# Altium schematic sheet RF_Antenna_Power.SchDoc: RF and Crystal
size Letter; Author: Parth Thakkar; Organization: Low Self Esteam; Revision: v1.0; SheetNumber: 2; SheetTotal: 8
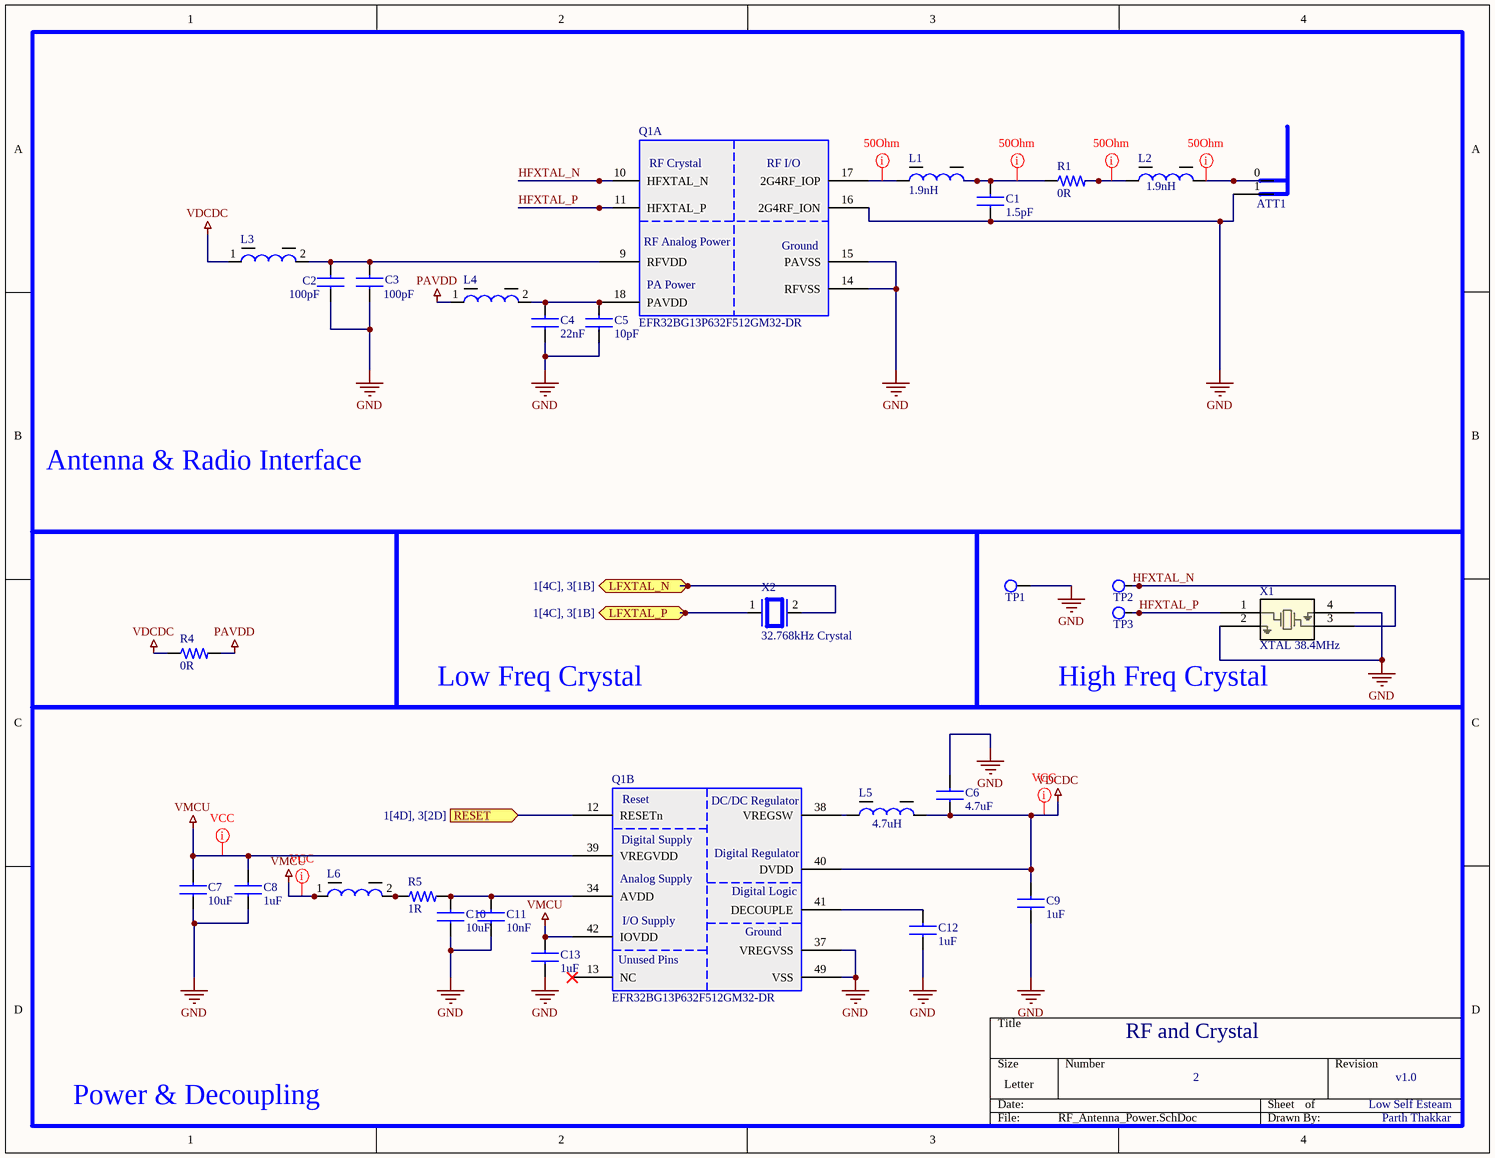
[diagram p0: RF_Antenna_Power.SchDoc]

## Parts
ATT1  F_Interverted  [F_Inverted]  (value not drawn)  (net tie, no BOM)
C1  value 1.5pF  [Capacitor 0402]  (hidden comment: CAP 1.5pF 50V 0402)
C2  value 100pF  [Capacitor 0603]  (hidden comment: CAP 100pF 100V 0603)
C3  value 100pF  [Capacitor 0603]  (hidden comment: CAP 100pF 100V 0603)
C4  value 22nF  [Capacitor 0603]  (hidden comment: CAP 220nF 50V 0603)
C5  value 10pF  [Capacitor 0603]  (hidden comment: CAP 10pF 50V 0603)
C6  value 4.7uF  [Capacitor 0603]  (hidden comment: CAP 4.7uF 25V 0603)
C7  value 10uF  [Capacitor 0603]  (hidden comment: CAP 10uF 10V 0603)
C8  value 1uF  [Capacitor 0603]  (hidden comment: CAP 1uF 10V 0603)
C9  value 1uF  [Capacitor 0603]  (hidden comment: CAP 1uF 10V 0603)
C10  value 10uF  [Capacitor 0603]  (hidden comment: CAP 10uF 10V 0603)
C11  value 10nF  [Capacitor 0603]  (hidden comment: CAP 10nF 100V 0603)
C12  value 1uF  [Capacitor 0603]  (hidden comment: CAP 1uF 10V 0603)
C13  value 1uF  [Capacitor 0603]  (hidden comment: CAP 1uF 10V 0603)
L1  1.9nH  [Ferrite 0402]
L2  1.9nH  [Ferrite 0402]
L3  Ferrite Bead 600(601) 1LN  [Ferrite 0603]  (value not drawn)
L4  Ferrite Bead 600(601) 1LN  [Ferrite 0603]  (value not drawn)
L5  Inductance-Nom (L): 4.7uH  [IND 22uH (1.6x4.3)]  (hidden comment: IND 4.7uH 1515)
L6  Farrite Bead 102(1k)  [Ferrite 0402]  (value not drawn)
Q1  EFR32BG13P632F512GM32-DR  [EFR32BG]  (parts A,B of 3)
R1  value 0R  [Resistor 0402]  (hidden comment: RES 0R 0402)
R4  value 0R  [Resistor 0402]  (hidden comment: RES 0R 0402)
R5  value 1R  [Resistor 0603]  (hidden comment: RES 1R 0603)
TP1  Test point  [Test Point]  (value not drawn)  (net tie, no BOM)
TP2  Test point  [Test Point]  (value not drawn)  (net tie, no BOM)
TP3  Test point  [Test Point]  (value not drawn)  (net tie, no BOM)
X1  XTAL 38.4MHz  [XTAL 38.4MHz]
X2  32.768kHz Crystal  [XTAL_32.768KHZ-T]

## Blocks framed on the sheet
Antenna & Radio Interface: ATT1 C1-C5 L1-L4 Q1 R1
Low Freq Crystal: X2
High Freq Crystal: TP1-TP3 X1
Power & Decoupling: C6-C13 L5 L6 Q1 R5

## Ports
LFXTAL_N (bidir, see 1[4C], 3[1B]), LFXTAL_P (bidir, see 1[4C], 3[1B]), RESET (in, see 1[4D], 3[2D])

## Nets
GND: ATT1.1(GND) C1.2 C2.2 C3.2 C4.2 C5.2 C6.2 C7.2 C8.2 C9.2 C10.2 C11.2 C12.2 C13.2 Q1.14(RFVSS) Q1.15(PAVSS) Q1.16(2G4RF_ION) Q1.37(VREGVSS) Q1.49(VSS) TP1.1 X1.2 X1.4
PAVDD: L4.1 R4.2
VDCDC: C6.1 C9.1 L3.1 L5.2 Q1.40(DVDD) R4.1
VMCU: C7.1 C8.1 C13.1 L6.1 Q1.39(VREGVDD) Q1.42(IOVDD)
HFXTAL_N: Q1.10(HFXTAL_N) TP2.1 X1.3
HFXTAL_P: Q1.11(HFXTAL_P) TP3.1 X1.1
LFXTAL_N: X2.2 ; port LFXTAL_N
LFXTAL_P: X2.1 ; port LFXTAL_P
RESET: Q1.12(RESETn) ; port RESET
NetATT1_0: ATT1.0(FEED) L2.2
NetC1_1: C1.1 L1.2 R1.1
NetC2_1: C2.1 C3.1 L3.2 Q1.9(RFVDD)
NetC4_1: C4.1 C5.1 L4.2 Q1.18(PAVDD)
NetC10_1: C10.1 C11.1 Q1.34(AVDD) R5.2
NetC12_1: C12.1 Q1.41(DECOUPLE)
NetL1_1: L1.1 Q1.17(2G4RF_IOP)
NetL2_1: L2.1 R1.2
NetL5_1: L5.1 Q1.38(VREGSW)
NetL6_2: L6.2 R5.1

Not connected (* = marked no-connect by the designer): Q1 13(NC)*

## Layout directives
rule Width Constraint [Pref Width = 20mil    Min Width = 6mil    Max Width = 20mil]: VDCDC, VMCU
net class RF: NetATT1_0, NetC1_1, NetL1_1, NetL2_1

## Notes on the sheet
- (in symbol EFR32BG13P632F512GM32-DR, part A) RF Crystal; RF I/O; RF Analog Power; Ground; PA Power
- (in symbol EFR32BG13P632F512GM32-DR, part B) Reset; DC/DC Regulator; Digital Supply; Digital Regulator; Analog Supply; Digital Logic; I/O Supply; Ground; Unused Pins

## Library data of the parts
ATT1 = F_Interverted: For 50Ohm impedence, Inverted F antenna; pin to pad: 0>FEED 1>GND
C1 = CAP 1.5pF 50V 0402: Ceramic Capacitor, Multilayer, Ceramic, 50V, 3.33% +Tol, 3.33% -Tol, C0G, 30ppm/Cel TC, 0.0000015uF, Surface Mount, 0402; Manufacturer: Murata; Manufacturer Part Number: GJM1555C1H1R5WB01D; Multilayer: Yes; Supplier: Digikey; Supplier Part Number: 490-11199-1-ND; RoHS: Yes; Category: Ceramic Capacitors; Stock: 52422; Pricing: 1=0.16, 10=0.091, 50=0.0634, 100=0.0549, 500=0.04062, 1000=0.03616, 2500=0.03144, 5000=0.02857 (USD); Mounting Technology: Surface Mount; Pins: 2; Dielectric Material: Ceramic; Package Shape: Rectangular; Case/Package: 0402; Terminal Finish: Nickel; Min Operating Temperature: -55°C; Max Operating Temperature: 125°C; JESD-609 Code: e3; Capacitor Type: Ceramic; Tolerance  (fill in as +-): 3.33%; Package Style: SMTMeter; Packaging: Tape and Reel; Tolerance (fill in as +-): 3.33%; Rated DC Voltage (URdc): 50V; Temperature Characteristics Code: C0G; Termination: Wraparound; Length: 1mm; Width: 0.5mm; Height: 0.5mm; Reach SVHC Compliant: Yes; RoHS Compliant: Yes; ComponentLink1URL: https://datasheet.ciiva.com:443/pdfs/VipMasterIC/IC/MURE/MURE-S-A0004378008/MURE-S-A0004383770-1.pdf?src-supplier=IHS+Markit; ComponentLink1Description: https://datasheet.ciiva.com:443/pdfs/VipMasterIC/IC/MURE/MURE-S-A0004378008/MURE-S-A0004383770-1.pdf?src-supplier=IHS+Markit; ComponentLink2URL: https://datasheet.ciiva.com/18183/getdatasheetpartid-312921-18183825.pdf?src-supplier=Verical; ComponentLink2Description: https://datasheet.ciiva.com/18183/getdatasheetpartid-312921-18183825.pdf?src-supplier=Verical
C2 C3 = CAP 100pF 100V 0603: Ceramic Capacitor, Multilayer, Ceramic, 100V, 5% +Tol, 5% -Tol, C0G, 30ppm/Cel TC, 0.0001uF, Surface Mount, 0603; Manufacturer: Murata; Manufacturer Part Number: GCM1885C2A101JA16D; Multilayer: Yes; Reference Standard: AEC-Q200; Supplier: Digikey; Supplier Part Number: 490-4771-1-ND; RoHS: Yes; Category: Ceramic Capacitors; Stock: 419530; Pricing: 1=0.1, 10=0.041, 50=0.0278, 100=0.0237, 500=0.017, 1000=0.01491 (USD); Mounting Technology: Surface Mount; Pins: 2; Dielectric Material: Ceramic; Package Shape: Rectangular; Case/Package: 0603; Terminal Finish: Nickel; Min Operating Temperature: -55°C; Max Operating Temperature: 125°C; JESD-609 Code: e3; Capacitor Type: Ceramic; Tolerance  (fill in as +-): 5%; Package Style: SMTMeter; Packaging: Tape and Reel; Tolerance (fill in as +-): 5%; Rated DC Voltage (URdc): 100V; Temperature Characteristics Code: C0G; Termination: Wraparound; Length: 1.6mm; Width: 0.8mm; Height: 0.9mm; Reach SVHC Compliant: Yes; RoHS Compliant: Yes; ComponentLink1URL: https://datasheet.ciiva.com:443/pdfs/VipMasterIC/IC/MURE/MURE-S-A0004365318/MURE-S-A0004370465-1.pdf?src-supplier=IHS+Markit; ComponentLink1Description: https://datasheet.ciiva.com:443/pdfs/VipMasterIC/IC/MURE/MURE-S-A0004365318/MURE-S-A0004370465-1.pdf?src-supplier=IHS+Markit; ComponentLink2URL: https://datasheet.ciiva.com/133/product-133309.pdf?src-supplier=Digikey; ComponentLink2Description: https://datasheet.ciiva.com/133/product-133309.pdf?src-supplier=Digikey; ComponentLink3URL: https://datasheet.ciiva.com/133/product-133310.pdf?src-supplier=Digikey; ComponentLink3Description: https://datasheet.ciiva.com/133/product-133310.pdf?src-supplier=Digikey; ComponentLink4URL: https://datasheet.ciiva.com/133/product-133311.pdf?src-supplier=Digikey; ComponentLink4Description: https://datasheet.ciiva.com/133/product-133311.pdf?src-supplier=Digikey; ComponentLink5URL: https://datasheet.ciiva.com/18183/getdatasheetpartid-223913-18183585.pdf?src-supplier=Verical; ComponentLink5Description: https://datasheet.ciiva.com/18183/getdatasheetpartid-223913-18183585.pdf?src-supplier=Verical; ComponentLink6URL: https://datasheet.ciiva.com/11605/product-11605527.pdf?src-supplier=Avnet; ComponentLink6Description: https://datasheet.ciiva.com/11605/product-11605527.pdf?src-supplier=Avnet
C4 = CAP 220nF 50V 0603: Ceramic Capacitor, Multilayer, Ceramic, 50V, 10% +Tol, 10% -Tol, X7R, 15% TC, 0.022uF, Surface Mount, 0603; Manufacturer: Murata; Manufacturer Part Number: GRM155R71H223KA12D; Multilayer: Yes; Reference Standard: AEC-Q200; Supplier: Digikey; Supplier Part Number: 490-3884-1-ND; RoHS: Yes; Category: Ceramic Capacitors; Stock: 581872; Pricing: 1=0.1, 10=0.022, 50=0.0148, 100=0.0125, 500=0.00878, 1000=0.00762, 2500=0.00639, 5000=0.00565, 10000=0.00504, 20000=0.00453, 30000=0.00428, 50000=0.004, 70000=0.00383, 100000=0.00367, 250000=0.00333, 500000=0.00312, 1000000=0.00294 (USD); Mounting Technology: Surface Mount; Pins: 2; Dielectric Material: Ceramic; Package Shape: Rectangular; Case/Package: 0402; Terminal Finish: Nickel; Min Operating Temperature: -55°C; Max Operating Temperature: 125°C; JESD-609 Code: e3; Capacitor Type: Ceramic; Tolerance  (fill in as +-): 10%; Package Style: SMTMeter; Packaging: Tape and Reel; Tolerance (fill in as +-): 10%; Rated DC Voltage (URdc): 50V; Temperature Characteristics Code: X7R; Termination: Wraparound; Length: 1mm; Width: 0.5mm; Height: 0.5mm; Reach SVHC Compliant: Yes; RoHS Compliant: Yes; ComponentLink1URL: https://datasheet.ciiva.com:443/pdfs/VipMasterIC/IC/MURE/MURE-S-A0008911298/MURE-S-A0008911312-1.pdf?src-supplier=IHS+Markit; ComponentLink1Description: https://datasheet.ciiva.com:443/pdfs/VipMasterIC/IC/MURE/MURE-S-A0008911298/MURE-S-A0008911312-1.pdf?src-supplier=IHS+Markit; ComponentLink2URL: https://datasheet.ciiva.com/11789/0900766b80ef921d-11789142.pdf?src-supplier=Rs; ComponentLink2Description: https://datasheet.ciiva.com/11789/0900766b80ef921d-11789142.pdf?src-supplier=Rs; ComponentLink3URL: https://datasheet.ciiva.com/18184/getdatasheetpartid-178940-18184738.pdf?src-supplier=Verical; ComponentLink3Description: https://datasheet.ciiva.com/18184/getdatasheetpartid-178940-18184738.pdf?src-supplier=Verical; ComponentLink4URL: https://datasheet.ciiva.com/29199/454297-da-01-en-vs-kondensator-0402-29199766.pdf?src-supplier=Conrad; ComponentLink4Description: https://datasheet.ciiva.com/29199/454297-da-01-en-vs-kondensator-0402-29199766.pdf?src-supplier=Conrad; ComponentLink5URL: https://datasheet.ciiva.com/7937/608985-7937629.pdf?src-supplier=Element14; ComponentLink5Description: https://datasheet.ciiva.com/7937/608985-7937629.pdf?src-supplier=Element14; ComponentLink6URL: https://datasheet.ciiva.com/131/partnumbering-e-01-131078.pdf?src-supplier=Digikey; ComponentLink6Description: https://datasheet.ciiva.com/131/partnumbering-e-01-131078.pdf?src-supplier=Digikey; ComponentLink7URL: https://datasheet.ciiva.com/131/partnumbering-e-01-131079.pdf?src-supplier=Digikey; ComponentLink7Description: https://datasheet.ciiva.com/131/partnumbering-e-01-131079.pdf?src-supplier=Digikey; ComponentLink8URL: https://datasheet.ciiva.com/131/partnumbering-e-01-131080.pdf?src-supplier=Digikey; ComponentLink8Description: https://datasheet.ciiva.com/131/partnumbering-e-01-131080.pdf?src-supplier=Digikey; ComponentLink9URL: https://datasheet.ciiva.com/22698/608985-22698424.pdf?src-supplier=Element14; ComponentLink9Description: https://datasheet.ciiva.com/22698/608985-22698424.pdf?src-supplier=Element14; ComponentLink10URL: https://datasheet.ciiva.com/16440/l0005e-16440589.pdf?src-supplier=Future+Electronics; ComponentLink10Description: https://datasheet.ciiva.com/16440/l0005e-16440589.pdf?src-supplier=Future+Electronics; ComponentLink11URL: https://datasheet.ciiva.com:443/pdfs/VipMasterIC/IC/MURE/MURE-S-A0004362469/MURE-S-A0004362882-1.pdf?src-supplier=IHS+Markit; ComponentLink11Description: https://datasheet.ciiva.com:443/pdfs/VipMasterIC/IC/MURE/MURE-S-A0004362469/MURE-S-A0004362882-1.pdf?src-supplier=IHS+Markit; ComponentLink12URL: https://datasheet.ciiva.com/29540/product-29540839.pdf?src-supplier=Digikey; ComponentLink12Description: https://datasheet.ciiva.com/29540/product-29540839.pdf?src-supplier=Digikey; ComponentLink13URL: https://datasheet.ciiva.com/29540/product-29540840.pdf?src-supplier=Digikey; ComponentLink13Description: https://datasheet.ciiva.com/29540/product-29540840.pdf?src-supplier=Digikey; ComponentLink14URL: https://datasheet.ciiva.com/29540/product-29540841.pdf?src-supplier=Digikey; ComponentLink14Description: https://datasheet.ciiva.com/29540/product-29540841.pdf?src-supplier=Digikey; ComponentLink15URL: https://datasheet.ciiva.com/11619/product-11619420.pdf?src-supplier=Avnet; ComponentLink15Description: https://datasheet.ciiva.com/11619/product-11619420.pdf?src-supplier=Avnet
C5 = CAP 10pF 50V 0603: Ceramic Capacitor, Multilayer, Ceramic, 100V, 5% +Tol, 5% -Tol, C0G, 30ppm/Cel TC, 0.00001uF, Surface Mount, 0603; Manufacturer: Murata; Manufacturer Part Number: GRM1555C1H100FA01D; Multilayer: Yes; Tolerance  (fill in as +-): 1%; Reference Standard: AEC-Q200; Supplier: Digikey; Supplier Part Number: 490-6186-1-ND; RoHS: Yes; Category: Ceramic Capacitors; Stock: 4693307; Pricing: 1=0.1, 10=0.03, 50=0.0204, 100=0.0174, 500=0.0125, 1000=0.01097, 2500=0.00936, 5000=0.00838 (USD); Mounting Technology: Surface Mount; Pins: 2; Dielectric Material: Ceramic; Package Shape: Rectangular; Case/Package: 0402; Terminal Finish: Nickel; Min Operating Temperature: -55°C; Max Operating Temperature: 125°C; JESD-609 Code: e3; Capacitor Type: Ceramic; Packaging: Tape and Reel; Tolerance (fill in as +-): 1%; Rated DC Voltage (URdc): 50V; Temperature Characteristics Code: C0G; Termination: Wraparound; Reach SVHC Compliant: Yes; RoHS Compliant: Yes; ComponentLink1URL: https://datasheet.ciiva.com:443/pdfs/VipMasterIC/IC/MURE/MURE-S-A0004347008/MURE-S-A0004347294-1.pdf?src-supplier=IHS+Markit; ComponentLink1Description: https://datasheet.ciiva.com:443/pdfs/VipMasterIC/IC/MURE/MURE-S-A0004347008/MURE-S-A0004347294-1.pdf?src-supplier=IHS+Markit; ComponentLink2URL: https://datasheet.ciiva.com/6263/partnumbering-e-01-6263819.pdf?src-supplier=Digikey; ComponentLink2Description: https://datasheet.ciiva.com/6263/partnumbering-e-01-6263819.pdf?src-supplier=Digikey; ComponentLink3URL: https://datasheet.ciiva.com/6263/partnumbering-e-01-6263822.pdf?src-supplier=Digikey; ComponentLink3Description: https://datasheet.ciiva.com/6263/partnumbering-e-01-6263822.pdf?src-supplier=Digikey; Package Style: SMTMeter; Length: 1.6mm; Width: 0.8mm; Height: 0.9mm; ComponentLink4URL: https://datasheet.ciiva.com:443/pdfs/VipMasterIC/IC/MURE/MURE-S-A0004365318/MURE-S-A0004370306-1.pdf?src-supplier=IHS+Markit; ComponentLink4Description: https://datasheet.ciiva.com:443/pdfs/VipMasterIC/IC/MURE/MURE-S-A0004365318/MURE-S-A0004370306-1.pdf?src-supplier=IHS+Markit; ComponentLink5URL: https://datasheet.ciiva.com/133/product-133480.pdf?src-supplier=Digikey; ComponentLink5Description: https://datasheet.ciiva.com/133/product-133480.pdf?src-supplier=Digikey; ComponentLink6URL: https://datasheet.ciiva.com/133/product-133481.pdf?src-supplier=Digikey; ComponentLink6Description: https://datasheet.ciiva.com/133/product-133481.pdf?src-supplier=Digikey; ComponentLink7URL: https://datasheet.ciiva.com/133/product-133482.pdf?src-supplier=Digikey; ComponentLink7Description: https://datasheet.ciiva.com/133/product-133482.pdf?src-supplier=Digikey; ComponentLink8URL: https://datasheet.ciiva.com/18183/getdatasheetpartid-307287-18183583.pdf?src-supplier=Verical; ComponentLink8Description: https://datasheet.ciiva.com/18183/getdatasheetpartid-307287-18183583.pdf?src-supplier=Verical; ComponentLink9URL: https://datasheet.ciiva.com/11607/product-11607353.pdf?src-supplier=Avnet; ComponentLink9Description: https://datasheet.ciiva.com/11607/product-11607353.pdf?src-supplier=Avnet
C6 = CAP 4.7uF 25V 0603: Ceramic Capacitor, Multilayer, Ceramic, 25V, 10% +Tol, 10% -Tol, X5R, 15% TC, 4.7uF, Surface Mount, 0603; Manufacturer: Murata; Manufacturer Part Number: GRT188R61E475KE13D; Multilayer: Yes; Reference Standard: AEC-Q200; Supplier: Digikey; Supplier Part Number: 490-12328-1-ND; RoHS: Yes; Category: Ceramic Capacitors; Stock: 959263; Pricing: 1=0.19, 10=0.111, 50=0.0792, 100=0.0693, 500=0.05246, 1000=0.04721 (USD); Mounting Technology: Surface Mount; Pins: 2; Dielectric Material: Ceramic; Package Shape: Rectangular; Case/Package: 0603; Terminal Finish: Nickel; Min Operating Temperature: -55°C; Max Operating Temperature: 85°C; JESD-609 Code: e3; Capacitor Type: Ceramic; Tolerance  (fill in as +-): 10%; Packaging: Tape and Reel; Tolerance (fill in as +-): 10%; Rated DC Voltage (URdc): 25V; Temperature Characteristics Code: X5R; Termination: Wraparound; Reach SVHC Compliant: Yes; RoHS Compliant: Yes; ComponentLink1URL: https://psearch.en.murata.com:443/capacitor/product/GRT188R61E475KE13%23.pdf?src-supplier=IHS+Markit; ComponentLink1Description: https://psearch.en.murata.com:443/capacitor/product/GRT188R61E475KE13%23.pdf?src-supplier=IHS+Markit; ComponentLink2URL: http://www.farnell.com/datasheets/2165958.pdf?src-supplier=Farnell; ComponentLink2Description: http://www.farnell.com/datasheets/2165958.pdf?src-supplier=Farnell; ComponentLink3URL: http://search.murata.co.jp/Ceramy/image/img/A01X/G101/ENG/GRT188R61E475KE13-01.pdf?src-supplier=Digikey; ComponentLink3Description: http://search.murata.co.jp/Ceramy/image/img/A01X/G101/ENG/GRT188R61E475KE13-01.pdf?src-supplier=Digikey; ComponentLink4URL: https://datasheet.octopart.com/GRT188R61E475KE13D-Murata-datasheet-67697750.pdf?src-supplier=Newark; ComponentLink4Description: https://datasheet.octopart.com/GRT188R61E475KE13D-Murata-datasheet-67697750.pdf?src-supplier=Newark; ComponentLink5URL: http://www.farnell.com/datasheets/2165958.pdf?src-supplier=Element14; ComponentLink5Description: http://www.farnell.com/datasheets/2165958.pdf?src-supplier=Element14; ComponentLink6URL: https://datasheet.octopart.com/GRT188R61E475KE13D-Murata-datasheet-165579666.pdf?src-supplier=TME; ComponentLink6Description: https://datasheet.octopart.com/GRT188R61E475KE13D-Murata-datasheet-165579666.pdf?src-supplier=TME
C7 C10 = CAP 10uF 10V 0603: Ceramic Capacitor, Multilayer, Ceramic, 10V, 20% +Tol, 20% -Tol, X5R, 15% TC, 10uF, Surface Mount, 0603; Manufacturer: Murata; Manufacturer Part Number: GRM188R61A106ME69D; Multilayer: Yes; Supplier: Digikey; Supplier Part Number: 490-10475-1-ND; RoHS: Yes; Category: Ceramic Capacitors; Stock: 738560; Pricing: 1=0.13, 10=0.075, 50=0.0518, 100=0.0448, 500=0.03284, 1000=0.02913, 4000=0.02354, 8000=0.02144, 12000=0.02039, 20000=0.01922, 28000=0.01853, 40000=0.01787, 100000=0.01643, 200000=0.01556, 400000=0.01484 (USD); Mounting Technology: Surface Mount; Pins: 2; Dielectric Material: Ceramic; Package Shape: Rectangular; Case/Package: 0603; Terminal Finish: Nickel; Min Operating Temperature: -55°C; Max Operating Temperature: 85°C; JESD-609 Code: e3; Capacitor Type: Ceramic; Tolerance  (fill in as +-): 20%; Packaging: Tape and Reel; Tolerance (fill in as +-): 20%; Rated DC Voltage (URdc): 10V; Temperature Characteristics Code: X5R; Termination: Wraparound; Reach SVHC Compliant: Yes; RoHS Compliant: Yes; ComponentLink1URL: https://datasheet.ciiva.com:443/pdfs/VipMasterIC/IC/MURE/MURE-S-A0004349797/MURE-S-A0004352786-1.pdf?src-supplier=IHS+Markit; ComponentLink1Description: https://datasheet.ciiva.com:443/pdfs/VipMasterIC/IC/MURE/MURE-S-A0004349797/MURE-S-A0004352786-1.pdf?src-supplier=IHS+Markit; ComponentLink2URL: http://www.mouser.com/ds/2/281/c02e-2905.pdf?src-supplier=Mouser; ComponentLink2Description: http://www.mouser.com/ds/2/281/c02e-2905.pdf?src-supplier=Mouser; ComponentLink3URL: http://www.farnell.com/datasheets/1872210.pdf?src-supplier=Farnell; ComponentLink3Description: http://www.farnell.com/datasheets/1872210.pdf?src-supplier=Farnell; ComponentLink4URL: https://datasheet.octopart.com/GRM188R61A106ME69D-Murata-datasheet-62317187.pdf?src-supplier=Element14; ComponentLink4Description: https://datasheet.octopart.com/GRM188R61A106ME69D-Murata-datasheet-62317187.pdf?src-supplier=Element14; ComponentLink5URL: https://datasheet.octopart.com/GRM188R61A106ME69D-Murata-datasheet-22122223.pdf?src-supplier=Future+Electronics; ComponentLink5Description: https://datasheet.octopart.com/GRM188R61A106ME69D-Murata-datasheet-22122223.pdf?src-supplier=Future+Electronics; ComponentLink6URL: http://search.murata.co.jp/Ceramy/image/img/A01X/G101/ENG/GRM188R61A106ME69-01.pdf?src-supplier=Digikey; ComponentLink6Description: http://search.murata.co.jp/Ceramy/image/img/A01X/G101/ENG/GRM188R61A106ME69-01.pdf?src-supplier=Digikey; ComponentLink7URL: http://www.farnell.com/datasheets/1872210.pdf?src-supplier=Newark; ComponentLink7Description: http://www.farnell.com/datasheets/1872210.pdf?src-supplier=Newark; ComponentLink8URL: http://www.farnell.com/datasheets/2048014.pdf?src-supplier=Element14; ComponentLink8Description: http://www.farnell.com/datasheets/2048014.pdf?src-supplier=Element14; ComponentLink9URL: http://www.farnell.com/datasheets/1872210.pdf?src-supplier=Element14; ComponentLink9Description: http://www.farnell.com/datasheets/1872210.pdf?src-supplier=Element14; ComponentLink10URL: https://datasheet.octopart.com/GRM188R61A106ME69D-Murata-datasheet-165579666.pdf?src-supplier=TME; ComponentLink10Description: https://datasheet.octopart.com/GRM188R61A106ME69D-Murata-datasheet-165579666.pdf?src-supplier=TME
C8 C9 C12 C13 = CAP 1uF 10V 0603: Ceramic Capacitor, Multilayer, Ceramic, 10V, 10% +Tol, 10% -Tol, X5R, 15% TC, 1uF, Surface Mount, 0603; Manufacturer: Murata; Manufacturer Part Number: GRM188R61A105KA61D; Multilayer: Yes; Supplier: Digikey; Supplier Part Number: 490-1543-1-ND; RoHS: Yes; Category: Ceramic Capacitors; Stock: 2506225; Pricing: 1=0.1, 10=0.059, 50=0.0408, 100=0.0354, 500=0.0261, 1000=0.02321 (USD); Mounting Technology: Surface Mount; Pins: 2; Dielectric Material: Ceramic; Package Shape: Rectangular; Case/Package: 0603; Terminal Finish: Nickel; Min Operating Temperature: -55°C; Max Operating Temperature: 85°C; JESD-609 Code: e3; Capacitor Type: Ceramic; Tolerance  (fill in as +-): 10%; Package Style: SMTMeter; Packaging: Tape and Reel; Tolerance (fill in as +-): 10%; Rated DC Voltage (URdc): 10V; Temperature Characteristics Code: X5R; Termination: Wraparound; Length: 1.6mm; Width: 0.8mm; Height: 0.8mm; Reach SVHC Compliant: Yes; RoHS Compliant: Yes; ComponentLink1URL: https://psearch.en.murata.com:443/capacitor/product/GRM188R61A105KA61%23.pdf?src-supplier=IHS+Markit; ComponentLink1Description: https://psearch.en.murata.com:443/capacitor/product/GRM188R61A105KA61%23.pdf?src-supplier=IHS+Markit; ComponentLink2URL: https://datasheet.ciiva.com/18102/getdatasheetpartid-85467-18102910.pdf?src-supplier=Verical; ComponentLink2Description: https://datasheet.ciiva.com/18102/getdatasheetpartid-85467-18102910.pdf?src-supplier=Verical; ComponentLink3URL: https://datasheet.ciiva.com/19476/1857381-19476568.pdf?src-supplier=Jameco; ComponentLink3Description: https://datasheet.ciiva.com/19476/1857381-19476568.pdf?src-supplier=Jameco; ComponentLink4URL: https://datasheet.ciiva.com/7719/608985-7719036.pdf?src-supplier=Element14; ComponentLink4Description: https://datasheet.ciiva.com/7719/608985-7719036.pdf?src-supplier=Element14; ComponentLink5URL: https://datasheet.ciiva.com/22706/608985-22706782.pdf?src-supplier=Element14; ComponentLink5Description: https://datasheet.ciiva.com/22706/608985-22706782.pdf?src-supplier=Element14; ComponentLink6URL: https://datasheet.ciiva.com/131/partnumbering-e-01-131741.pdf?src-supplier=Digikey; ComponentLink6Description: https://datasheet.ciiva.com/131/partnumbering-e-01-131741.pdf?src-supplier=Digikey; ComponentLink7URL: https://datasheet.ciiva.com/131/partnumbering-e-01-131742.pdf?src-supplier=Digikey; ComponentLink7Description: https://datasheet.ciiva.com/131/partnumbering-e-01-131742.pdf?src-supplier=Digikey; ComponentLink8URL: https://datasheet.ciiva.com/131/partnumbering-e-01-131743.pdf?src-supplier=Digikey; ComponentLink8Description: https://datasheet.ciiva.com/131/partnumbering-e-01-131743.pdf?src-supplier=Digikey; ComponentLink9URL: https://datasheet.ciiva.com/16199/product-16199724.pdf?src-supplier=Future+Electronics; ComponentLink9Description: https://datasheet.ciiva.com/16199/product-16199724.pdf?src-supplier=Future+Electronics
C11 = CAP 10nF 100V 0603: Ceramic Capacitor, Multilayer, Ceramic, 100V, 10% +Tol, 10% -Tol, X7R, 15% TC, 0.01uF, Surface Mount, 0603; Manufacturer: Murata; Manufacturer Part Number: GCM188R72A103KA37D; Multilayer: Yes; Reference Standard: AEC-Q200; Supplier: Digikey; Supplier Part Number: 490-4781-1-ND; RoHS: Yes; Category: Ceramic Capacitors; Stock: 6259212; Pricing: 1=0.1, 10=0.03, 50=0.0204, 100=0.0174, 500=0.0125, 1000=0.01097, 4000=0.00978, 8000=0.00881, 12000=0.00833, 20000=0.00779, 28000=0.00747, 40000=0.00716, 100000=0.0065, 200000=0.00638 (USD); Mounting Technology: Surface Mount; Pins: 2; Dielectric Material: Ceramic; Package Shape: Rectangular; Case/Package: 0603; Terminal Finish: Nickel; Min Operating Temperature: -55°C; Max Operating Temperature: 125°C; JESD-609 Code: e3; Capacitor Type: Ceramic; Tolerance  (fill in as +-): 10%; Package Style: SMTMeter; Packaging: Tape and Reel; Tolerance (fill in as +-): 10%; Rated DC Voltage (URdc): 100V; Temperature Characteristics Code: X7R; Termination: Wraparound; Length: 1.6mm; Width: 0.8mm; Height: 0.9mm; Reach SVHC Compliant: Yes; RoHS Compliant: Yes; ComponentLink1URL: https://psearch.en.murata.com:443/capacitor/product/GCM188R72A103KA37%23.pdf?src-supplier=IHS+Markit; ComponentLink1Description: https://psearch.en.murata.com:443/capacitor/product/GCM188R72A103KA37%23.pdf?src-supplier=IHS+Markit; ComponentLink2URL: https://datasheet.ciiva.com/132/product-132907.pdf?src-supplier=Digikey; ComponentLink2Description: https://datasheet.ciiva.com/132/product-132907.pdf?src-supplier=Digikey; ComponentLink3URL: https://datasheet.ciiva.com/132/product-132908.pdf?src-supplier=Digikey; ComponentLink3Description: https://datasheet.ciiva.com/132/product-132908.pdf?src-supplier=Digikey; ComponentLink4URL: https://datasheet.ciiva.com/132/product-132909.pdf?src-supplier=Digikey; ComponentLink4Description: https://datasheet.ciiva.com/132/product-132909.pdf?src-supplier=Digikey; ComponentLink5URL: https://datasheet.ciiva.com/11786/0900766b80ef92d0-11786108.pdf?src-supplier=Rs; ComponentLink5Description: https://datasheet.ciiva.com/11786/0900766b80ef92d0-11786108.pdf?src-supplier=Rs; ComponentLink6URL: https://datasheet.ciiva.com/16497/product-16497251.pdf?src-supplier=Future+Electronics; ComponentLink6Description: https://datasheet.ciiva.com/16497/product-16497251.pdf?src-supplier=Future+Electronics; ComponentLink7URL: https://datasheet.ciiva.com/18183/getdatasheetpartid-178890-18183651.pdf?src-supplier=Verical; ComponentLink7Description: https://datasheet.ciiva.com/18183/getdatasheetpartid-178890-18183651.pdf?src-supplier=Verical; ComponentLink8URL: https://datasheet.ciiva.com/11619/product-11619719.pdf?src-supplier=Avnet; ComponentLink8Description: https://datasheet.ciiva.com/11619/product-11619719.pdf?src-supplier=Avnet
L1 L2 = IND 1.9nH 0402: Inductor Chip 1.9nH 0.3nH Tolerance 2-Pin 0402 Paper T/R; Manufacturer: Murata; Manufacturer Part Number: LQG15WZ1N9S02D; Shielding: Unshielded; DC Resistance (DCR): 50mR; Self Resonant Frequency: 8GHz; Test Frequency: 100MHz; Supplier: Digikey; Supplier Part Number: 490-LQG15WZ1N9S02DCT-ND; RoHS: Yes; Category: Fixed Inductors; Stock: 2657; Pricing: 1=0.12, 10=0.093, 25=0.084, 50=0.0778, 100=0.0722, 250=0.06528, 500=0.06048, 1000=0.05605, 2500=0.05066 (USD); Mounting Technology: Surface Mount; Case/Package: 0402; Min Operating Temperature: -55°C; Max Operating Temperature: 125°C; Series: LQG15; Value: 1.9nH; Ratings: AEC-Q200; RoHS Compliant: Yes; ComponentLink1URL: https://search.murata.co.jp/Ceramy/image/img/P02/JELF243B-9117.pdf?src-supplier=Digikey; ComponentLink1Description: https://search.murata.co.jp/Ceramy/image/img/P02/JELF243B-9117.pdf?src-supplier=Digikey
L3 L4 = Ferrite Bead 600(601) 1LN: RFVDD, PAVDD, EFR; Manufacturer: Murata; Manufacturer Part Number: BLM18AG601SN1D; DC Resistance-Max: 380mR; Filter Type: FERRITE CHIP; Clock Frequency: 100MHz; Channels: 1; Output Impedance: 600R; Current Rating: 500mA; Supplier: Digikey; Supplier Part Number: 490-1014-1-ND; RoHS: Yes; Category: Ferrite Beads and Chips; Stock: 669813; Pricing: 1=0.1, 10=0.058, 25=0.0504, 50=0.0452, 100=0.0405, 250=0.03488, 500=0.03106, 1000=0.02756 (USD); Mounting Technology: Surface Mount; Material: Ferrite; Case Code: 0603; Terminal Finish: Nickel; Min Operating Temperature: -55°C; Max Operating Temperature: 125°C; JESD-609 Code: e3; Construction: Chip Bead; Min Frequency: 100MHz; Packaging: Tape and Reel; Length: 1.6mm; Width: 0.8mm; Height: 0.8mm; Reach SVHC Compliant: Yes; RoHS Compliant: Yes; ComponentLink1URL: https://datasheet.ciiva.com:443/pdfs/VipMasterIC/IC/MURE/MURE-S-A0008871331/MURE-S-A0008870588-1.pdf?src-supplier=IHS+Markit; ComponentLink1Description: https://datasheet.ciiva.com:443/pdfs/VipMasterIC/IC/MURE/MURE-S-A0008871331/MURE-S-A0008870588-1.pdf?src-supplier=IHS+Markit; ComponentLink2URL: https://datasheet.ciiva.com/19460/1844766-19460213.pdf?src-supplier=Jameco; ComponentLink2Description: https://datasheet.ciiva.com/19460/1844766-19460213.pdf?src-supplier=Jameco; ComponentLink3URL: https://datasheet.ciiva.com/29347/442309-da-01-en-chip-drossel-0603-600r-500ma-1-6x0-8mm-29347900.pdf?src-supplier=Conrad; ComponentLink3Description: https://datasheet.ciiva.com/29347/442309-da-01-en-chip-drossel-0603-600r-500ma-1-6x0-8mm-29347900.pdf?src-supplier=Conrad; ComponentLink4URL: https://datasheet.ciiva.com/41449/001172228-da-01-en-drossel-0603-600r-1-6x0-8mm-4000st-41449517.pdf?src-supplier=Conrad; ComponentLink4Description: https://datasheet.ciiva.com/41449/001172228-da-01-en-drossel-0603-600r-1-6x0-8mm-4000st-41449517.pdf?src-supplier=Conrad; ComponentLink5URL: https://datasheet.ciiva.com/1012/l0110s0100blm18a-1012017.pdf?src-supplier=Digikey; ComponentLink5Description: https://datasheet.ciiva.com/1012/l0110s0100blm18a-1012017.pdf?src-supplier=Digikey; ComponentLink6URL: https://datasheet.ciiva.com/1012/l0110s0100blm18a-1012018.pdf?src-supplier=Digikey; ComponentLink6Description: https://datasheet.ciiva.com/1012/l0110s0100blm18a-1012018.pdf?src-supplier=Digikey; ComponentLink7URL: https://datasheet.ciiva.com/1012/l0110s0100blm18a-1012019.pdf?src-supplier=Digikey; ComponentLink7Description: https://datasheet.ciiva.com/1012/l0110s0100blm18a-1012019.pdf?src-supplier=Digikey; ComponentLink8URL: https://datasheet.ciiva.com/3081/l0110s0100blm18a-3081613.pdf?src-supplier=Avnet; ComponentLink8Description: https://datasheet.ciiva.com/3081/l0110s0100blm18a-3081613.pdf?src-supplier=Avnet
L5 = IND 4.7uH 1515: General Purpose Inductor, 4.7uH, 30%, 1 Element, Ferrite-Core, SMD, 1515; Manufacturer: Wurth Electronics; Manufacturer Part Number: 744031004; Case/Size Code: 1515; DC Resistance (DCR): 105mR; Inductor Application: POWER INDUCTOR; Channels: 1; Max Current Rating: 1.2A; Self Resonant Frequency: 75MHz; Shape/Size Description: RECTANGULAR PACKAGE; Shielding: Unshielded; Test Frequency: 100kHz; Package Height: 1.65mm; Package Length: 3.8mm; Supplier: Digikey; Supplier Part Number: 732-1008-1-ND; RoHS: Yes; Category: Fixed Inductors; Stock: 8696; Pricing: 1=1.52, 10=1.481, 50=1.296, 100=1.185, 500=1.044 (USD); Pins: 2; Core Material: Ferrite; Terminal Finish: Copper; Min Operating Temperature: -40°C; Max Operating Temperature: 115°C; Tolerance: 30%; JESD-609 Code: e1; Construction: Chip; Inductor Type: GENERAL PURPOSE INDUCTOR; Package Style: SMTMeter; Packaging: Tape and Reel; Surface Mount: Yes; Terminal Placement: Dual Ended; Termination: One Surface; Package Width: 3.8mm; RoHS Compliant: Yes; Reach SVHC Compliant: Yes; ComponentLink1URL: https://datasheet.ciiva.com:443/pdfs/VipMasterIC/IC/MIDC/MIDC-S-A0002801302/MIDC-S-A0002801302-1.pdf?src-supplier=IHS+Markit; ComponentLink1Description: https://datasheet.ciiva.com:443/pdfs/VipMasterIC/IC/MIDC/MIDC-S-A0002801302/MIDC-S-A0002801302-1.pdf?src-supplier=IHS+Markit; ComponentLink2URL: https://datasheet.ciiva.com/7210/744031004-7210940.pdf?src-supplier=Newark; ComponentLink2Description: https://datasheet.ciiva.com/7210/744031004-7210940.pdf?src-supplier=Newark; ComponentLink3URL: https://datasheet.ciiva.com/11800/0900766b8079f7b1-11800238.pdf?src-supplier=Rs; ComponentLink3Description: https://datasheet.ciiva.com/11800/0900766b8079f7b1-11800238.pdf?src-supplier=Rs; ComponentLink4URL: https://datasheet.ciiva.com/4961/744031004-18796-4961279.pdf?src-supplier=Mouser; ComponentLink4Description: https://datasheet.ciiva.com/4961/744031004-18796-4961279.pdf?src-supplier=Mouser; ComponentLink5URL: https://datasheet.ciiva.com/22702/1910986-22702636.pdf?src-supplier=Element14; ComponentLink5Description: https://datasheet.ciiva.com/22702/1910986-22702636.pdf?src-supplier=Element14; ComponentLink6URL: https://datasheet.ciiva.com/14123/lm744031004-data-de-14123798.pdf?src-supplier=Distrelec; ComponentLink6Description: https://datasheet.ciiva.com/14123/lm744031004-data-de-14123798.pdf?src-supplier=Distrelec; ComponentLink7URL: https://datasheet.ciiva.com/1050/744031004-1050615.pdf?src-supplier=Digikey; ComponentLink7Description: https://datasheet.ciiva.com/1050/744031004-1050615.pdf?src-supplier=Digikey; ComponentLink8URL: https://datasheet.ciiva.com/1050/744031004-1050616.pdf?src-supplier=Digikey; ComponentLink8Description: https://datasheet.ciiva.com/1050/744031004-1050616.pdf?src-supplier=Digikey; ComponentLink9URL: https://datasheet.ciiva.com/1050/744031004-1050617.pdf?src-supplier=Digikey; ComponentLink9Description: https://datasheet.ciiva.com/1050/744031004-1050617.pdf?src-supplier=Digikey
L6 = Farrite Bead 102(1k): Ferrite Chip, 1 Function(s), 0.05A, 2 Pin(s); Manufacturer: Wurth Electronics; Manufacturer Part Number: 742841210; DC Resistance-Max: 1.8R; Channels: 1; Output Impedance: 1kR; Current Rating: 50mA; Approvals: IECV; Supplier: Digikey; Supplier Part Number: 732-2363-1-ND; RoHS: Yes; Category: Ferrite Beads and Chips; Stock: 18596; Pricing: 1=0.25, 100=0.239, 500=0.215, 1000=0.203, 2000=0.191 (USD); Mounting Technology: Surface Mount; Terminal Finish: Nickel; Min Operating Temperature: -55°C; Max Operating Temperature: 125°C; JESD-609 Code: e3; Filter Type: FERRITE CHIP; Packaging: Tape and Reel; Length: 1mm; Width: 0.5mm; Height: 0.5mm; Reach SVHC Compliant: Yes; RoHS Compliant: Yes; ComponentLink1URL: https://datasheet.ciiva.com:443/pdfs/VipMasterIC/IC/MIDC/MIDC-S-A0010058265/MIDC-S-A0010058302-1.pdf?src-supplier=IHS+Markit; ComponentLink1Description: https://datasheet.ciiva.com:443/pdfs/VipMasterIC/IC/MIDC/MIDC-S-A0010058265/MIDC-S-A0010058302-1.pdf?src-supplier=IHS+Markit; ComponentLink2URL: https://datasheet.ciiva.com/1013/742841210-1013608.pdf?src-supplier=Digikey; ComponentLink2Description: https://datasheet.ciiva.com/1013/742841210-1013608.pdf?src-supplier=Digikey; ComponentLink3URL: https://datasheet.ciiva.com/23763/742841210-23763049.pdf?src-supplier=Newark; ComponentLink3Description: https://datasheet.ciiva.com/23763/742841210-23763049.pdf?src-supplier=Newark; ComponentLink4URL: https://datasheet.ciiva.com/30490/0900766b812a6786-30490017.pdf?src-supplier=Rs; ComponentLink4Description: https://datasheet.ciiva.com/30490/0900766b812a6786-30490017.pdf?src-supplier=Rs; ComponentLink5URL: https://datasheet.ciiva.com/4942/742841210-66534-4942954.pdf?src-supplier=Mouser; ComponentLink5Description: https://datasheet.ciiva.com/4942/742841210-66534-4942954.pdf?src-supplier=Mouser; ComponentLink6URL: https://datasheet.ciiva.com/22711/1696154-22711446.pdf?src-supplier=Element14; ComponentLink6Description: https://datasheet.ciiva.com/22711/1696154-22711446.pdf?src-supplier=Element14; ComponentLink7URL: https://datasheet.ciiva.com/1466/1696154-1466628.pdf?src-supplier=Element14; ComponentLink7Description: https://datasheet.ciiva.com/1466/1696154-1466628.pdf?src-supplier=Element14
Q1 = EFR32BG13P632F512GM32-DR: BLue Gecko; Manufacturer: Silicon Labs; Supplier: Digikey; Supplier Part Number: 336-EFR32BG13P632F512GM32-DRCT-ND; Manufacturer Part Number: EFR32BG13P632F512GM32-DR; RoHS: No; Category: RF Receivers, Transceivers; Stock: 30445; Pricing: 1=6.93, 10=6.355, 25=5.7772, 100=5.1995, 250=4.7662, 500=4.3329, 1000=3.89961 (USD); RoHS Compliant: Yes; ComponentLink1URL: https://www.silabs.com/documents/login/data-sheets/efr32bg13-datasheet.pdf?src-supplier=Digikey; ComponentLink1Description: https://www.silabs.com/documents/login/data-sheets/efr32bg13-datasheet.pdf?src-supplier=Digikey
R1 R4 = RES 0R 0402: Metal Glaze/thick Film, 0.0625W, 0ohm, Surface Mount, 0402; Manufacturer: Yageo; Manufacturer Part Number: RC0402JR-070RL; Power: 62.5mW; Rated Temperature: 70°C; Package Height: 0.35mm; Package Length: 1mm; Package Width: 0.5mm; Supplier: Digikey; Supplier Part Number: 311-0.0JRCT-ND; RoHS: Yes; Category: Chip SMD Resistors; Stock: 15179907; Pricing: 1=0.1, 10=0.011, 25=0.0084, 50=0.0064, 100=0.0045, 250=0.00364, 500=0.0029, 1000=0.00214, 5000=0.00154, 10000=0.00133, 30000=0.00117, 50000=0.00107, 100000=0.00105 (USD); Mounting Technology: Surface Mount; Pins: 2; Package Shape: Rectangular; Case/Package: 0402; Terminal Finish: Nickel; Min Operating Temperature: -55°C; Max Operating Temperature: 155°C; JESD-609 Code: e3; Resistor Type: FIXED RESISTOR; Construction: Chip; Package Style: SMTMeter; Packaging: Tape and Reel; Technology: METAL GLAZE/THICK FILM; Termination: Wraparound; Reach SVHC Compliant: Yes; RoHS Compliant: Yes; ComponentLink1URL: https://datasheet.ciiva.com:443/pdfs/VipMasterIC/IC/YAGO/YAGO-S-A0008145938/YAGO-S-A0008145938-1.pdf?src-supplier=IHS+Markit; ComponentLink1Description: https://datasheet.ciiva.com:443/pdfs/VipMasterIC/IC/YAGO/YAGO-S-A0008145938/YAGO-S-A0008145938-1.pdf?src-supplier=IHS+Markit; ComponentLink2URL: https://datasheet.ciiva.com/2452/pyu-rc0402-51-rohs-l-6-2452608.pdf?src-supplier=Digikey; ComponentLink2Description: https://datasheet.ciiva.com/2452/pyu-rc0402-51-rohs-l-6-2452608.pdf?src-supplier=Digikey; ComponentLink3URL: https://datasheet.ciiva.com/11808/0900766b80c66297-11808195.pdf?src-supplier=Rs; ComponentLink3Description: https://datasheet.ciiva.com/11808/0900766b80c66297-11808195.pdf?src-supplier=Rs; ComponentLink4URL: https://datasheet.ciiva.com/2452/pyu-r-int-thick-7-2452609.pdf?src-supplier=Digikey; ComponentLink4Description: https://datasheet.ciiva.com/2452/pyu-r-int-thick-7-2452609.pdf?src-supplier=Digikey; ComponentLink5URL: https://datasheet.ciiva.com/2452/pyu-r-int-thick-7-2452610.pdf?src-supplier=Digikey; ComponentLink5Description: https://datasheet.ciiva.com/2452/pyu-r-int-thick-7-2452610.pdf?src-supplier=Digikey; ComponentLink6URL: https://datasheet.ciiva.com/8896/pyu-rc0402-51-rohs-l-6-8896201.pdf?src-supplier=Avnet; ComponentLink6Description: https://datasheet.ciiva.com/8896/pyu-rc0402-51-rohs-l-6-8896201.pdf?src-supplier=Avnet; ComponentLink7URL: https://datasheet.ciiva.com/7983/1018594-7983535.pdf?src-supplier=Element14; ComponentLink7Description: https://datasheet.ciiva.com/7983/1018594-7983535.pdf?src-supplier=Element14; ComponentLink8URL: https://datasheet.ciiva.com/22747/1018594-22747515.pdf?src-supplier=Element14; ComponentLink8Description: https://datasheet.ciiva.com/22747/1018594-22747515.pdf?src-supplier=Element14
R5 = RES 1R 0603: Fixed Resistor, Metal Glaze/thick Film, 0.1W, 1ohm, 75V, 1% +/-Tol, 200ppm/Cel, Surface Mount, 0603; Manufacturer: Yageo; Manufacturer Part Number: RC0603FR-071RL; Additional Feature: LASER TRIMMABLE; Power: 100mW; Rated Temperature: 70°C; Temperature Coefficient: 200ppm/°C; Package Height: 0.45mm; Package Length: 1.6mm; Package Width: 0.8mm; Supplier: Digikey; Supplier Part Number: 311-1.00HRCT-ND; RoHS: Yes; Category: Chip SMD Resistors; Stock: 1071408; Pricing: 1=0.1, 10=0.021, 50=0.0132, 100=0.0111, 500=0.0077, 1000=0.00666, 5000=0.00491, 10000=0.00437, 25000=0.0038, 35000=0.0037, 50000=0.00358 (USD); Mounting Technology: Surface Mount; Pins: 2; Package Shape: Rectangular; Case/Package: 0603; Terminal Finish: Nickel; Min Operating Temperature: -55°C; Max Operating Temperature: 155°C; Tolerance: 1%; JESD-609 Code: e3; Resistor Type: FIXED RESISTOR; Construction: Chip; Package Style: SMTMeter; Packaging: Tape and Reel; Technology: METAL GLAZE/THICK FILM; Termination: Wraparound; Working Voltage: 75V; Reach SVHC Compliant: Yes; RoHS Compliant: Yes; ComponentLink1URL: https://datasheet.ciiva.com:443/pdfs/VipMasterIC/IC/YAGO/YAGO-S-A0008145938/YAGO-S-A0008145938-1.pdf?src-supplier=IHS+Markit; ComponentLink1Description: https://datasheet.ciiva.com:443/pdfs/VipMasterIC/IC/YAGO/YAGO-S-A0008145938/YAGO-S-A0008145938-1.pdf?src-supplier=IHS+Markit; ComponentLink2URL: https://datasheet.ciiva.com/11808/0900766b80f96399-11808162.pdf?src-supplier=Rs; ComponentLink2Description: https://datasheet.ciiva.com/11808/0900766b80f96399-11808162.pdf?src-supplier=Rs; ComponentLink3URL: https://datasheet.ciiva.com/6547/pyu-r-int-thick-7-6547270.pdf?src-supplier=Digikey; ComponentLink3Description: https://datasheet.ciiva.com/6547/pyu-r-int-thick-7-6547270.pdf?src-supplier=Digikey; ComponentLink4URL: https://datasheet.ciiva.com/6547/pyu-r-int-thick-7-6547271.pdf?src-supplier=Digikey; ComponentLink4Description: https://datasheet.ciiva.com/6547/pyu-r-int-thick-7-6547271.pdf?src-supplier=Digikey; ComponentLink5URL: https://datasheet.ciiva.com/7746/1738695-7746296.pdf?src-supplier=Element14; ComponentLink5Description: https://datasheet.ciiva.com/7746/1738695-7746296.pdf?src-supplier=Element14; ComponentLink6URL: https://datasheet.ciiva.com/7746/1738695-7746297.pdf?src-supplier=Element14; ComponentLink6Description: https://datasheet.ciiva.com/7746/1738695-7746297.pdf?src-supplier=Element14; ComponentLink7URL: https://datasheet.ciiva.com/6547/pyu-r-int-thick-7-6547269.pdf?src-supplier=Digikey; ComponentLink7Description: https://datasheet.ciiva.com/6547/pyu-r-int-thick-7-6547269.pdf?src-supplier=Digikey
X1 = XTAL 38.4MHz: Crystal 38.4000MHZ 10PF SMD; Manufacturer: Murata; Manufacturer Part Number: XRCGB38M400F1S3JR0; Supplier: Digikey; Supplier Part Number: 490-XRCGB38M400F1S3JR0TR-ND; RoHS: No; Stock: 604; Pricing: 1=1.13, 10=1.004, 50=0.938, 100=0.829, 500=0.78538, 1000=0.65448 (USD); ComponentLink1URL: https://datasheet.octopart.com/TZ2205E-TST---Tamsan-datasheet-98782093.pdf?src-supplier=Component+Distributors+Inc.; ComponentLink1Description: https://datasheet.octopart.com/TZ2205E-TST---Tamsan-datasheet-98782093.pdf?src-supplier=Component+Distributors+Inc.; Category: LDO; ComponentLink2URL: http://www.txccorp.com/download/products/quartz_crystals/2015TXC_8Y_15.pdf?src-supplier=Digikey; ComponentLink2Description: http://www.txccorp.com/download/products/quartz_crystals/2015TXC_8Y_15.pdf?src-supplier=Digikey
X2 = 32.768kHz Crystal: Crystal 0.032768MHz ±20ppm (Tol) 12.5pF Flexural 70000Ohm 2-Pin CSMD T/R; Manufacturer: Abracon; Manufacturer Part Number: ABS07-32.768KHZ-H-T; Additional Feature: TAPE AND REEL; Aging: 3 PPM/FIRST YEAR; Crystal/Resonator Type: PARALLEL - FUNDAMENTAL; Drive Level: 0.5uW; ESR: 70kR; Supplier: Mouser; Supplier Part Number: 535-ABS07-32.768KHZ-H-TTR-ND; RoHS: Yes; Category: Crystals; Stock: 349794; Pricing: 1=0.64, 10=0.502, 50=0.502, 100=0.463, 500=0.438, 1000=0.419, 3000=0.308, 6000=0.281, 9000=0.269, 10000=0.269, 24000=0.258 (USD); Mounting Technology: Surface Mount; Min Operating Temperature: -40°C; Max Operating Temperature: 85°C; Frequency Tolerance: 20ppm; Load Capacitance: 12.5pF; Operating Frequency-Nom: 0.032768; Reach SVHC Compliant: Yes; RoHS Compliant: Yes; ComponentLink1URL: https://datasheet.ciiva.com:443/pdfs/VipMasterIC/IC/ABRC/ABRC-S-A0006623177/ABRC-S-A0006623177-1.pdf?src-supplier=IHS+Markit; ComponentLink1Description: https://datasheet.ciiva.com:443/pdfs/VipMasterIC/IC/ABRC/ABRC-S-A0006623177/ABRC-S-A0006623177-1.pdf?src-supplier=IHS+Markit; ComponentLink2URL: https://datasheet.ciiva.com/854/abs07-854935.pdf?src-supplier=Digikey; ComponentLink2Description: https://datasheet.ciiva.com/854/abs07-854935.pdf?src-supplier=Digikey; ComponentLink3URL: https://datasheet.ciiva.com/854/abs07-854936.pdf?src-supplier=Digikey; ComponentLink3Description: https://datasheet.ciiva.com/854/abs07-854936.pdf?src-supplier=Digikey; ComponentLink4URL: https://datasheet.ciiva.com/854/abs07-854937.pdf?src-supplier=Digikey; ComponentLink4Description: https://datasheet.ciiva.com/854/abs07-854937.pdf?src-supplier=Digikey; ComponentLink5URL: https://datasheet.ciiva.com/15214/getdatasheetpartid-727011-15214954.pdf?src-supplier=Verical; ComponentLink5Description: https://datasheet.ciiva.com/15214/getdatasheetpartid-727011-15214954.pdf?src-supplier=Verical; ComponentLink6URL: https://datasheet.ciiva.com/7998/1912628-7998667.pdf?src-supplier=Element14; ComponentLink6Description: https://datasheet.ciiva.com/7998/1912628-7998667.pdf?src-supplier=Element14; Case/Package: CSMD; Pins: 2; Package Quantity: 3000; Tolerance: 20ppm; ESR (Equivalent Series Resistance): 70kR; Frequency: 32.768kHz; Packaging: Tape and Reel; Termination: SMD/SMT; Series: ABS07; Operating Frequency: 32.768 kHz; Length: 3.2mm; Width: 1.5mm; Height: 0.9mm; Depth: 1.5mm; Radiation Hardening: No; Lead Free: Lead Free; ComponentLink7URL: https://datasheet.ciiva.com/1357/1883680-1357319.pdf?src-supplier=Element14; ComponentLink7Description: https://datasheet.ciiva.com/1357/1883680-1357319.pdf?src-supplier=Element14; ComponentLink8URL: https://datasheet.ciiva.com/4944/abs07-11028-4944830.pdf?src-supplier=Mouser; ComponentLink8Description: https://datasheet.ciiva.com/4944/abs07-11028-4944830.pdf?src-supplier=Mouser